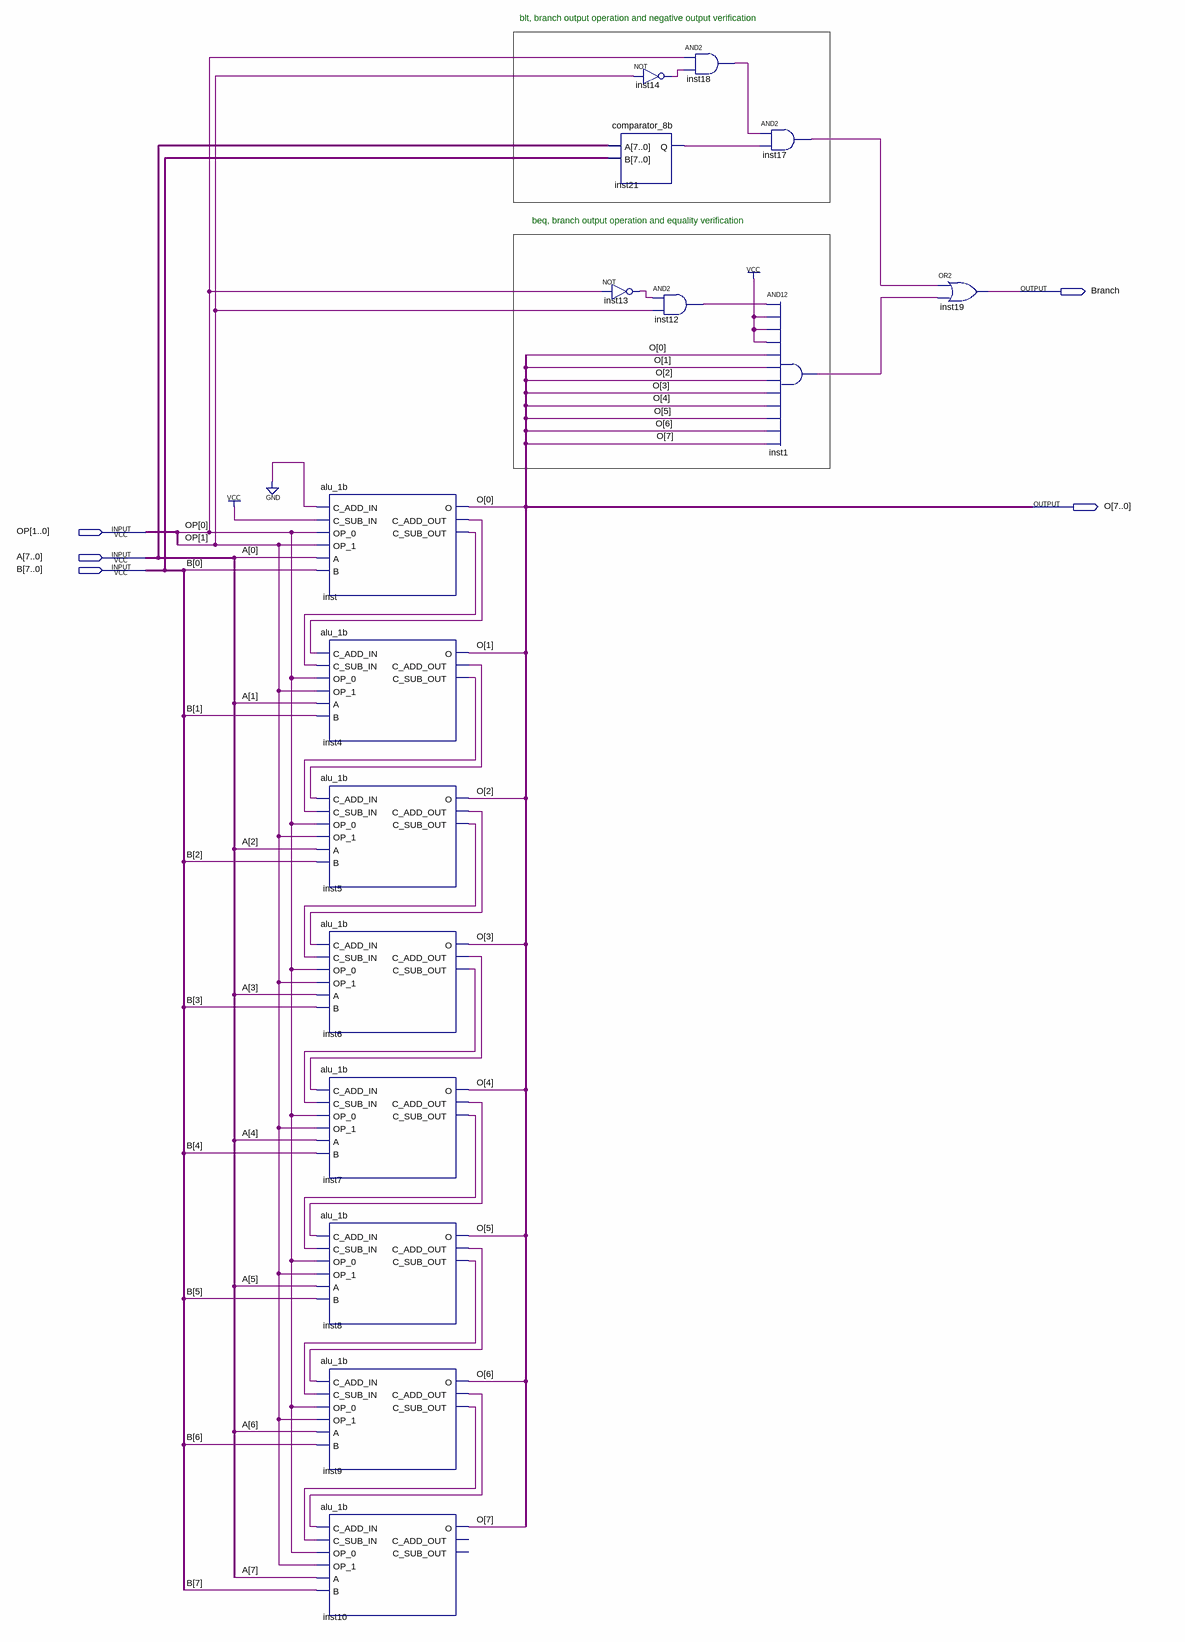
[diagram p0: schematic sheet]
// Quartus schematic alu_8b.bdf as structural Verilog: 16 symbols, 5 pins
module alu_8b (
  input  [1:0] OP,
  input  [7:0] A,
  input  [7:0] B,
  output Branch,
  output [7:0] O
);

  wire inst1_out, inst4_c_add_out, inst4_c_sub_out, inst5_c_add_out, inst5_c_sub_out, inst6_c_add_out,
       inst6_c_sub_out, inst7_c_add_out, inst7_c_sub_out, inst8_c_add_out, inst8_c_sub_out, inst9_c_add_out,
       inst9_c_sub_out, inst12_out, inst13_out, inst14_out, inst17_out, inst18_out, inst21_q, inst_c_add_out,
       inst_c_sub_out;

  alu_1b inst (
    .C_ADD_IN(1'b0), .C_SUB_IN(1'b1), .OP_0(OP[0]), .OP_1(OP[1]), .A(A[0]), .B(B[0]), .O(O[0]),
    .C_ADD_OUT(inst_c_add_out), .C_SUB_OUT(inst_c_sub_out));
  alu_1b inst4 (
    .C_ADD_IN(inst_c_add_out), .C_SUB_IN(inst_c_sub_out), .OP_0(OP[0]), .OP_1(OP[1]), .A(A[1]), .B(B[1]),
    .O(O[1]), .C_ADD_OUT(inst4_c_add_out), .C_SUB_OUT(inst4_c_sub_out));
  alu_1b inst5 (
    .C_ADD_IN(inst4_c_add_out), .C_SUB_IN(inst4_c_sub_out), .OP_0(OP[0]), .OP_1(OP[1]), .A(A[2]), .B(B[2]),
    .O(O[2]), .C_ADD_OUT(inst5_c_add_out), .C_SUB_OUT(inst5_c_sub_out));
  alu_1b inst6 (
    .C_ADD_IN(inst5_c_add_out), .C_SUB_IN(inst5_c_sub_out), .OP_0(OP[0]), .OP_1(OP[1]), .A(A[3]), .B(B[3]),
    .O(O[3]), .C_ADD_OUT(inst6_c_add_out), .C_SUB_OUT(inst6_c_sub_out));
  alu_1b inst7 (
    .C_ADD_IN(inst6_c_add_out), .C_SUB_IN(inst6_c_sub_out), .OP_0(OP[0]), .OP_1(OP[1]), .A(A[4]), .B(B[4]),
    .O(O[4]), .C_ADD_OUT(inst7_c_add_out), .C_SUB_OUT(inst7_c_sub_out));
  alu_1b inst8 (
    .C_ADD_IN(inst7_c_add_out), .C_SUB_IN(inst7_c_sub_out), .OP_0(OP[0]), .OP_1(OP[1]), .A(A[5]), .B(B[5]),
    .O(O[5]), .C_ADD_OUT(inst8_c_add_out), .C_SUB_OUT(inst8_c_sub_out));
  alu_1b inst9 (
    .C_ADD_IN(inst8_c_add_out), .C_SUB_IN(inst8_c_sub_out), .OP_0(OP[0]), .OP_1(OP[1]), .A(A[6]), .B(B[6]),
    .O(O[6]), .C_ADD_OUT(inst9_c_add_out), .C_SUB_OUT(inst9_c_sub_out));
  alu_1b inst10 (
    .C_ADD_IN(inst9_c_add_out), .C_SUB_IN(inst9_c_sub_out), .OP_0(OP[0]), .OP_1(OP[1]), .A(A[7]), .B(B[7]),
    .O(O[7]));  // open: C_ADD_OUT, C_SUB_OUT
  not inst14 (inst14_out, OP[1]);
  comparator_8b inst21 (.A(A), .B(B), .Q(inst21_q));
  not inst13 (inst13_out, OP[0]);
  and inst18 (inst18_out, OP[0], inst14_out);
  and inst12 (inst12_out, inst13_out, OP[1]);
  and inst17 (inst17_out, inst18_out, inst21_q);
  and inst1 (inst1_out, inst12_out, 1'b1, 1'b1, 1'b1, O[0], O[1], O[2], O[3], O[4], O[5], O[6], O[7]);
  or inst19 (Branch, inst17_out, inst1_out);

  // Notes on the sheet:
  //   blt, branch output operation and negative output verification
  //   beq, branch output operation and equality verification
endmodule
